# EAGLE schematic lcd (EAGLE 8.7.1)

## Sheet 1 of 2
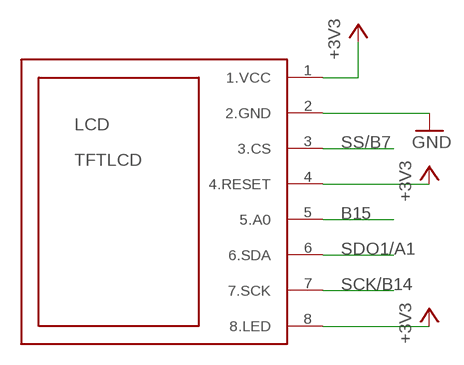
[diagram p0: schematic, sheet 1]

### Parts
LCD  TFTLCD  [1X08]

### Nets
+3V3: LCD.1(1.VCC) LCD.4(4.RESET) LCD.8(8.LED) ; also sheet 2
B15: LCD.5(5.A0)
GND: LCD.2(2.GND) ; also sheet 2
SCK/B14: LCD.7(7.SCK)
SDO1/A1: LCD.6(6.SDA)
SS/B7: LCD.3(3.CS)

## Sheet 2 of 2
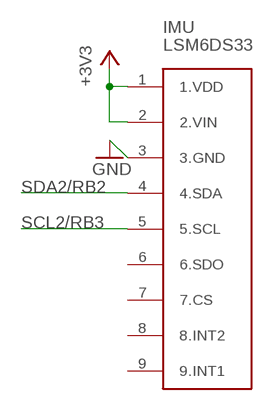
[diagram p1: schematic, sheet 2]

### Parts
IMU  LSM6DS33  [LSM6DS33]

### Nets
+3V3: IMU.1(1.VDD) IMU.2(2.VIN) ; also sheet 1
GND: IMU.3(3.GND) ; also sheet 1
SCL2/RB3: IMU.5(5.SCL)
SDA2/RB2: IMU.4(4.SDA)
Unconnected: IMU.6(6.SDO) IMU.7(7.CS) IMU.8(8.INT2) IMU.9(9.INT1)

## Library data of the parts
IMU = me433:LSM6DS33
LCD = me433:TFTLCD